# Altium schematic sheet Empty_Blackbox.SchDoc
size A3; DocumentNumber: 1; SheetNumber: 1; SheetTotal: 2
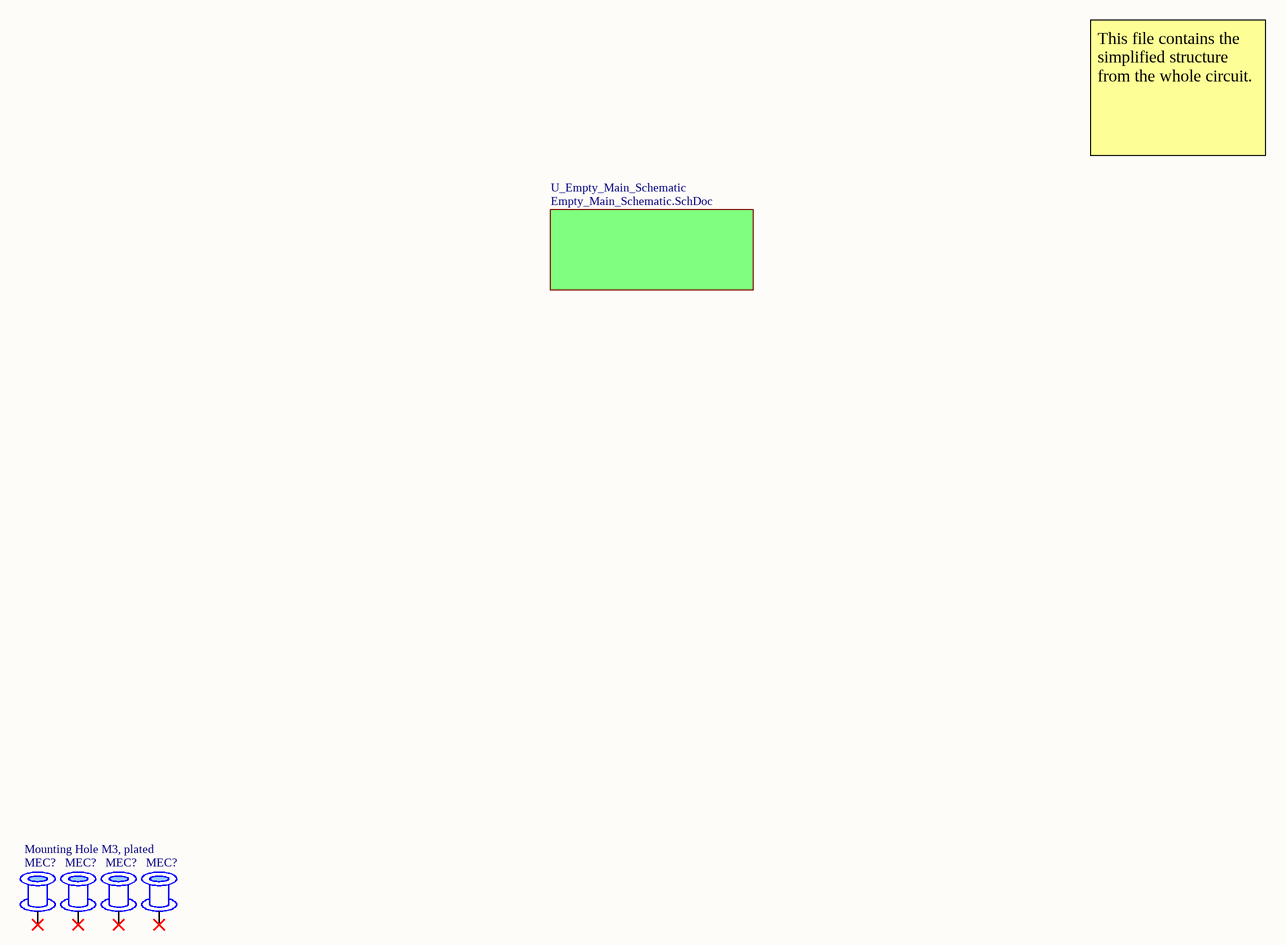
[diagram p0: Empty_Blackbox.SchDoc]

## Parts
(Parts that share a designator on the sheet are numbered #1, #2 ... from top to bottom, then left to right.)
MEC?#1  Mounting Hole M3, plated  [Mounting Hole M3, plated]
MEC?#2  Mounting Hole M3, plated  [Mounting Hole M3, plated]  (value not drawn)
MEC?#3  Mounting Hole M3, plated  [Mounting Hole M3, plated]  (value not drawn)
MEC?#4  Mounting Hole M3, plated  [Mounting Hole M3, plated]  (value not drawn)

## Sub-sheets
U_Empty_Main_Schematic = Empty_Main_Schematic.SchDoc: no entries

## Nets

Not connected (* = marked no-connect by the designer): MEC?#1 1*; MEC?#2 1*; MEC?#3 1*; MEC?#4 1*

## Notes on the sheet
- This file contains the simplified structure from the whole circuit.
- Date:
- Title of drawing:
- Time:
- Drawn by:
- Project:
- Revision:
- Institut:
- Departement:
- Page:
- from:
- File:

## Library data of the parts
MEC?#1-MEC?#4 = Mounting Hole M3, plated: Mounting Hole for M3 Screw, plated to connect signal